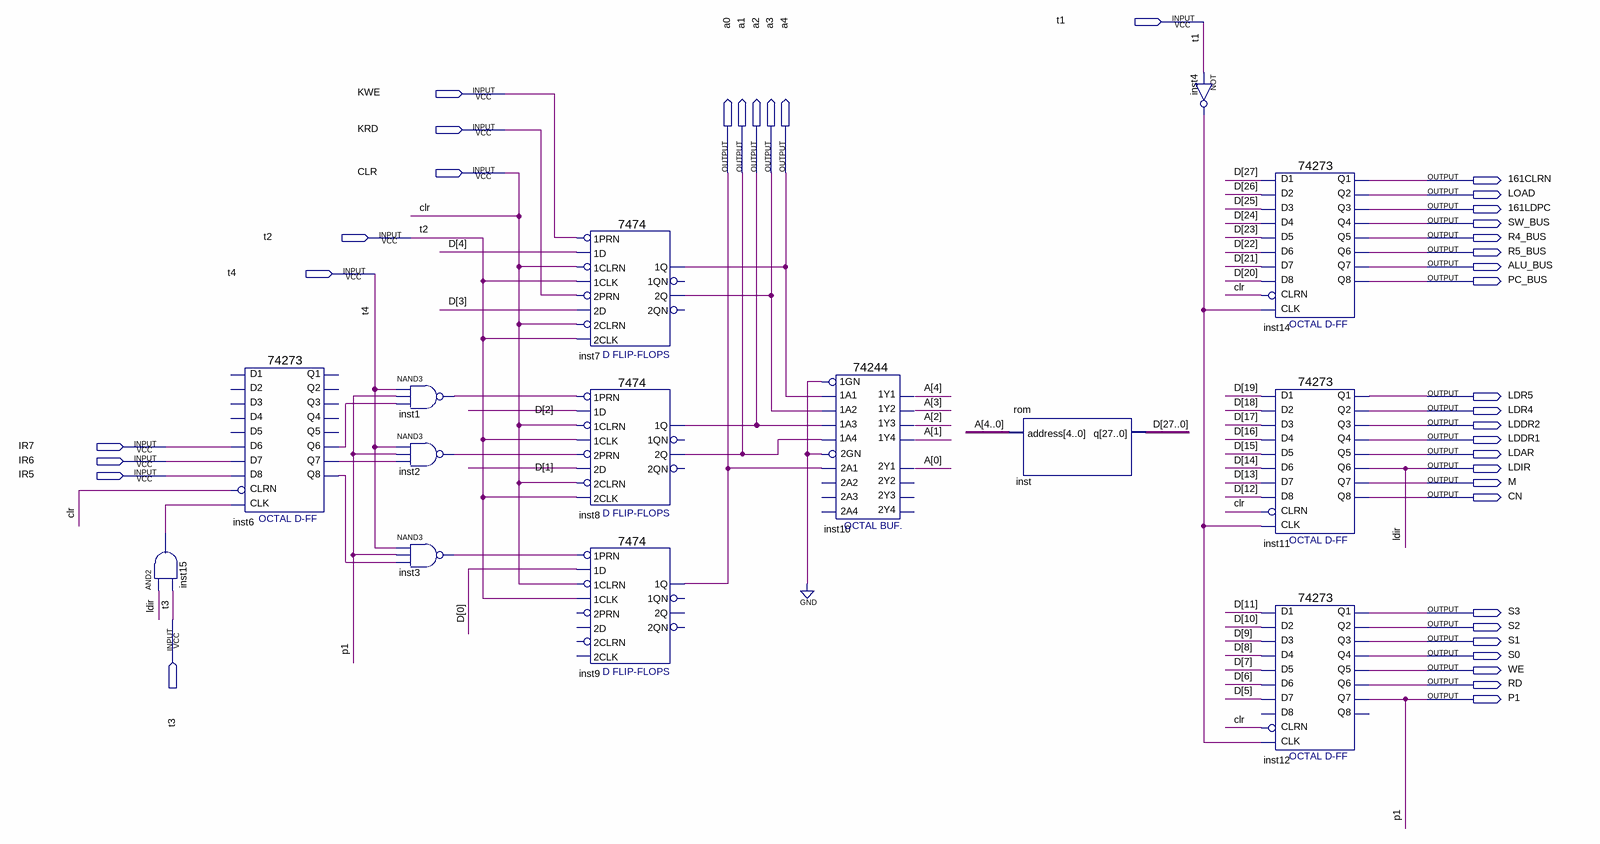
[diagram p0: schematic sheet]
// Quartus schematic zjw_kongzhiqi.bdf as structural Verilog: 14 symbols, 38 pins
module zjw_kongzhiqi (
  input  t1,
  input  KWE,
  input  KRD,
  input  CLR,
  input  t2,
  input  t4,
  input  IR7,
  input  IR6,
  input  IR5,
  input  t3,
  output a0,
  output a1,
  output a2,
  output a3,
  output a4,
  output \161CLRN ,
  output LOAD,
  output \161LDPC ,
  output SW_BUS,
  output R4_BUS,
  output R5_BUS,
  output ALU_BUS,
  output PC_BUS,
  output LDR5,
  output LDR4,
  output LDDR2,
  output LDDR1,
  output LDAR,
  output LDIR,
  output M,
  output CN,
  output S3,
  output S2,
  output S1,
  output S0,
  output WE,
  output RD,
  output P1
);

  wire inst1_out, inst2_out, inst3_out, inst4_out, inst6_q6, inst6_q7, inst6_q8, inst15_out;
  wire [27:0] D;

  and inst15 (inst15_out, LDIR, t3);
  \74273  inst6 (
    .D7(IR6), .D6(IR7), .D8(IR5), .CLK(inst15_out), .CLRN(CLR), .Q6(inst6_q6), .Q7(inst6_q7), .Q8(inst6_q8));  // open: D2, D3, D1, D4, D5, Q4, Q1, Q2, Q3, Q5
  nand inst1 (inst1_out, t4, P1, inst6_q6);
  nand inst2 (inst2_out, t4, P1, inst6_q7);
  nand inst3 (inst3_out, t4, P1, inst6_q8);
  \7474  inst7 (
    .\2D (D[3]), .\2PRN (KRD), .\1CLK (t2), .\1D (D[4]), .\1PRN (KWE), .\2CLK (t2), .\2CLRN (CLR),
    .\1CLRN (CLR), .\2Q (a3), .\1Q (a4));  // open: 1QN, 2QN
  \7474  inst8 (
    .\2D (D[1]), .\2PRN (inst2_out), .\1CLK (t2), .\1D (D[2]), .\1PRN (inst1_out), .\2CLK (t2),
    .\2CLRN (CLR), .\1CLRN (CLR), .\2Q (a1), .\1Q (a2));  // open: 1QN, 2QN
  \7474  inst9 (
    .\1CLK (t2), .\1D (D[0]), .\1PRN (inst3_out), .\1CLRN (CLR), .\1Q (a0));  // open: 2D, 2PRN, 2CLK, 2CLRN, 1QN, 2Q, 2QN
  \74244  inst10 (
    .\1A2 (a3), .\1A4 (a1), .\1A1 (a4), .\1A3 (a2), .\1GN (1'b0), .\2GN (1'b0), .\2A1 (a0), .\1Y2 (a3),
    .\1Y4 (a1), .\2Y1 (a0), .\1Y1 (a4), .\1Y3 (a2));  // open: 2A3, 2A4, 2A2, 2Y3, 2Y4, 2Y2
  rom inst (.address({a4, a3, a2, a1, a0}), .q(D));
  not inst4 (inst4_out, t1);
  \74273  inst14 (
    .D2(D[26]), .D3(D[25]), .D1(D[27]), .D4(D[24]), .D7(D[21]), .D6(D[22]), .D5(D[23]), .D8(D[20]),
    .CLK(inst4_out), .CLRN(CLR), .Q4(SW_BUS), .Q1(\161CLRN ), .Q2(LOAD), .Q3(\161LDPC ), .Q6(R5_BUS),
    .Q5(R4_BUS), .Q7(ALU_BUS), .Q8(PC_BUS));
  \74273  inst11 (
    .D2(D[18]), .D3(D[17]), .D1(D[19]), .D4(D[16]), .D7(D[13]), .D6(D[14]), .D5(D[15]), .D8(D[12]),
    .CLK(inst4_out), .CLRN(CLR), .Q4(LDDR1), .Q1(LDR5), .Q2(LDR4), .Q3(LDDR2), .Q6(LDIR), .Q5(LDAR), .Q7(M),
    .Q8(CN));
  \74273  inst12 (
    .D2(D[10]), .D3(D[9]), .D1(D[11]), .D4(D[8]), .D7(D[5]), .D6(D[6]), .D5(D[7]), .CLK(inst4_out),
    .CLRN(CLR), .Q4(S0), .Q1(S3), .Q2(S2), .Q3(S1), .Q6(RD), .Q5(WE), .Q7(P1));  // open: D8, Q8
endmodule
